# EAGLE design v1 (EAGLE 5.12)
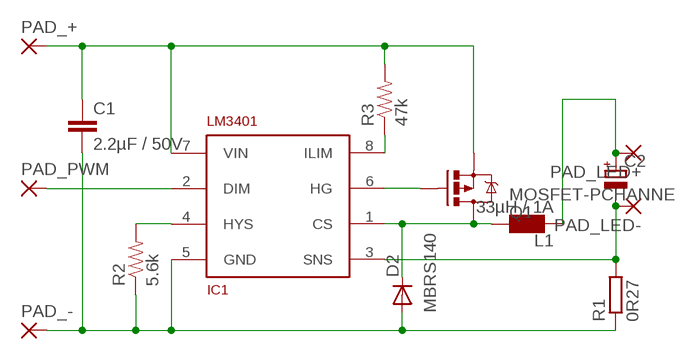
[diagram p0: schematic, sheet 1]

## Parts
C1  2.2µF / 50V  C-EUC1210  [C1210]
C2  CPOL-EUSMCA  [SMC_A]
D2  MBRS140  DIODE-SMB  [SMB]
IC1  LM3401  [MSOP8]
L1  33µH / 1A  L_PIS2816  [PIS2816]
PAD_+  SMD2  [SMD1,27-2,54]
PAD_-  SMD2  [SMD1,27-2,54]
PAD_LED+  SMD2  [SMD1,27-2,54]
PAD_LED-  SMD2  [SMD1,27-2,54]
PAD_PWM  SMD2  [SMD1,27-2,54]
Q1  MOSFET-PCHANNEL  [SOT23]
R1  0R27  R-EU_R1206  [R1206]
R2  5.6k  RESISTOR0805-RES  [0805]
R3  47k  RESISTOR0805-RES  [0805]

## Nets
GND: C1.2 D2.A IC1.5(GND) PAD_-.1(P) R1.1 R2.1
N$1: C2.- IC1.3(SNS) PAD_LED-.1(P) R1.2
N$2: C2.+ L1.P$2 PAD_LED+.1(P)
N$3: D2.C IC1.1(CS) L1.P$1 Q1.3(D)
N$5: IC1.4(HYS) R2.2
N$7: IC1.8(ILIM) R3.1
N$8: C1.1 IC1.7(VIN) PAD_+.1(P) Q1.2(S) R3.2
N$9: IC1.2(DIM) PAD_PWM.1(P)
N$10: IC1.6(HG) Q1.1(G)

## Library data of the parts
C1 = rcl:C-EU: CAPACITOR, European symbol
C2 = rcl:CPOL-EU: POLARIZED CAPACITOR, European symbol
D2 = diode:DIODE-: DIODE
IC1 = seb:LM3401
L1 = seb:L_PIS2816
PAD_+ PAD_- PAD_LED+ PAD_LED- PAD_PWM = wirepad:SMD2: SMD PAD
Q1 = SparkFun:MOSFET-PCHANNEL
R1 = rcl:R-EU_: RESISTOR, European symbol
R2 R3 = SparkFun:RESISTOR: Resistor Basic schematic elements and footprints for 0603, 1206, and PTH resistors.

## Board
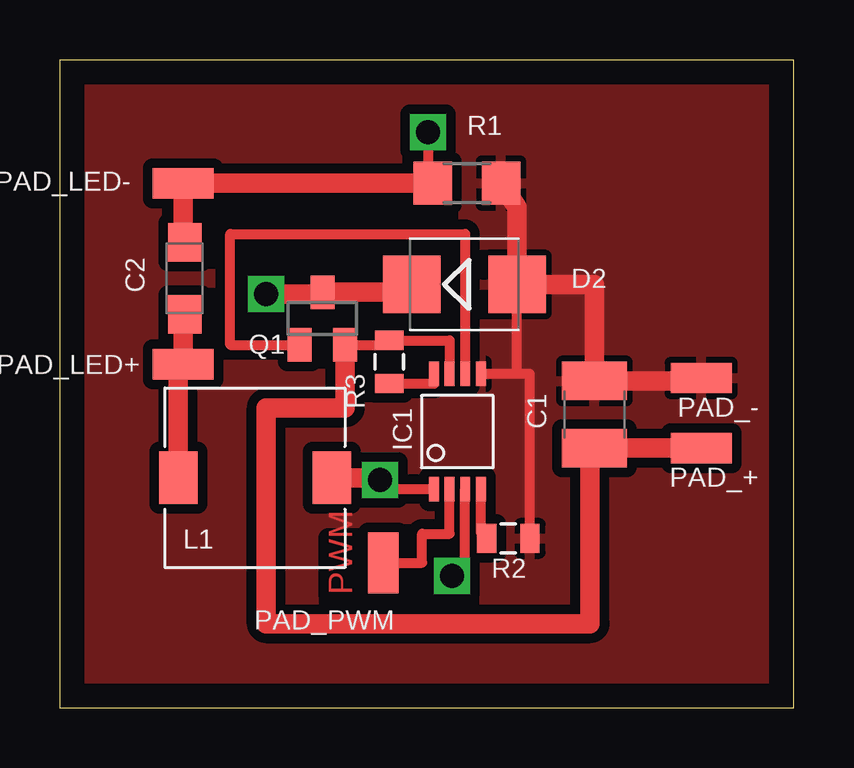
[diagram p1: board, top side]
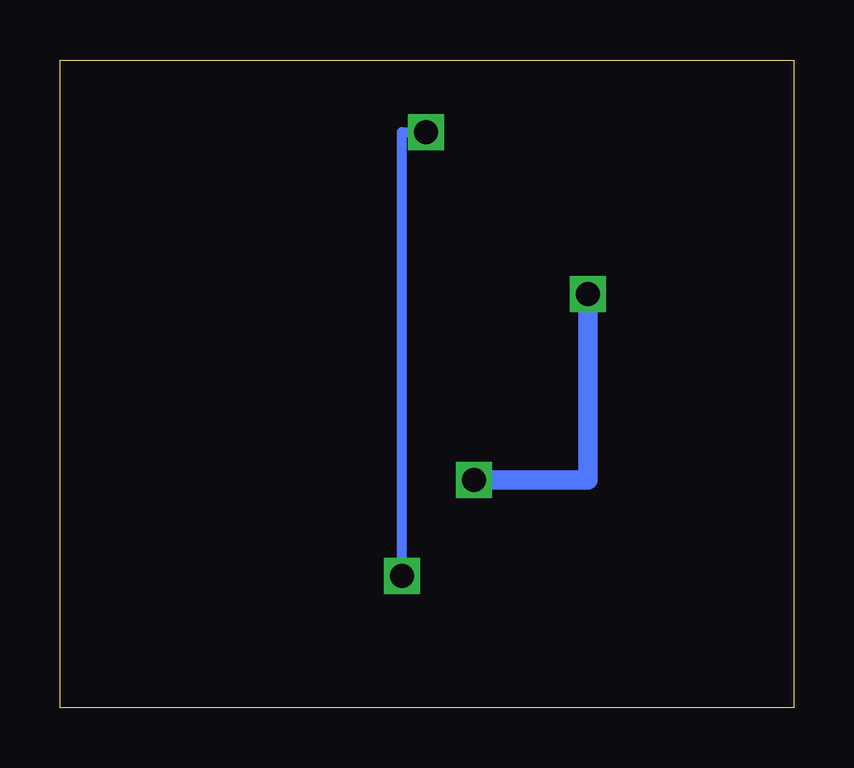
[diagram p2: board, bottom side, seen from below]

Size 30.6 x 27 mm. Coordinates in mm from the lower left corner, seen from the top.
Outline: 0,0 30.6,0 30.6,27 0,27 0,0
Copper layers (1*16): Top 0.035mm / dielectric 1.5mm / Bottom 0.035mm
Design rules "default": minimum track width 10mil, minimum drill 24mil, track to track 8mil, track to pad 8mil, pad to pad 8mil, via to via 8mil, smd to smd 8mil, copper to edge 40mil, drill to drill 8mil, minimum pad ring 10mil, minimum via ring 8mil, stop-mask expansion 4mil, vias tented up to drill 0mil, thermal gap 10mil

### Footprints (pad centres in the part's own frame; a part is rotated, then mirrored left to right if it is on the bottom)
C1210 = smd 1.6 x 2.7: 1 -1.4,0; 2 1.4,0
SMC_A = smd 1.6 x 1.4: + -1.5,0; - 1.5,0
SMB = smd 2.4 x 2.4: A 2.2,0; C -2.2,0
MSOP8 = smd 0.41 x 1.02: 1 -0.975,-2.4; 2 -0.325,-2.4; 3 0.325,-2.4; 4 0.975,-2.4; 5 0.975,2.4; 6 0.325,2.4; 7 -0.325,2.4; 8 -0.975,2.4
PIS2816 = smd 2.2 x 1.6: P$1 0,3.2; P$2 0,-3.2
SMD1,27-2,54 = smd 1.27 x 2.54: 1 0,0
SOT23 = smd 1 x 1.4: 1 -0.95,-1.1; 2 0.95,-1.1; 3 0,1.1
R1206 = smd 1.6 x 1.803: 1 -1.422,0; 2 1.422,0
0805 = smd 0.8 x 1.2: 1 -0.9,0; 2 0.9,0

### Placement (x,y rotation side)
C1  22.28,12.22 90 top
C2  5.2,17.9 90 top
D2  16.86,17.64 0 top
IC1  16.57,11.51 0 top
L1  8.13,9.58 270 top
PAD_+  26.73,10.82 90 top
PAD_-  26.73,13.74 90 top
PAD_LED+  5.14,14.32 90 top
PAD_LED-  5.14,21.86 90 top
PAD_PWM  13.47,6.04 0 top
Q1  10.94,16.22 0 top
R1  16.97,21.86 180 top
R2  18.69,7.05 180 top
R3  13.73,14.41 90 top

### Tracks (layer width: path | path; a pad name or v marks a point on that pad's centre or on a via)
GND
  Top 0.406: C1.2 22.28,13.5 | R2.1 19.59,13.91 19.06,13.91 | 19.06,13.91 D2.A | 19.06,13.91 IC1.5
  Top 0.813: R1.1 19.06,20.86 D2.A 22.28,17.64 C1.2 26.73,13.62 PAD_-.1
  pour Top (isolate 0.406): 0,0 30.6,0 30.6,27 0,27
N$1  (via drill 1)
  Top 0.406: IC1.3 16.89,5.5 v16.35,5.5 | v15.35,24 15.35,21.86
  Top 0.813: R1.2 15.35,21.86 PAD_LED-.1 5.14,20.15 C2.-
  Bottom 0.406: v16.35,5.5 16.35,24 v15.35,24
N$2
  Top 0.813: L1.P$2 4.93,14.32 PAD_LED+.1 5.14,15.9 C2.+
N$3  (via drill 1)
  Top 0.406: IC1.1 13.35,9.11 v13.35,9.5
  Top 0.813: D2.C 14.66,17.32 Q1.3 10.94,17.25 v8.6,17.25 | L1.P$1 13.35,9.58 v13.35,9.5
  Bottom 0.813: v13.35,9.5 8.6,9.5 v8.6,17.25
N$4
  pour Top: 1,11.7 3.2,11.7 3.2,25 1,25
  pour Top: 29.3,14.6 29.3,16.8 24.9,16.9 24.9,14.7
  pour Top: 29.3,7.4 29.3,9.6 24.3,9.6 24.3,7.4
N$5
  Top 0.406: IC1.4 17.55,7.31 R2.2
N$7
  Top 0.406: R3.1 15.59,13.51 IC1.8
N$8
  Top 0.406: IC1.7 16.25,15.31 R3.2 13.73,15.12 Q1.2
  Top 0.813: PAD_+.1 C1.1 22.1,10.82 22.1,3.5 8.6,3.5 8.6,12.5 11.89,12.5 Q1.2
N$9
  Top 0.406: IC1.2 16.25,7.25 15.1,7.25 15.1,6.04 PAD_PWM.1
N$10
  Top 0.406: Q1.1 7.1,15.12 7.1,19.75 16.89,19.75 IC1.6

### Text on the board
Top: PWM
tRestrict: LED- | GND | LED+ | +12V